# Altium project SencoreIB.PrjPcb
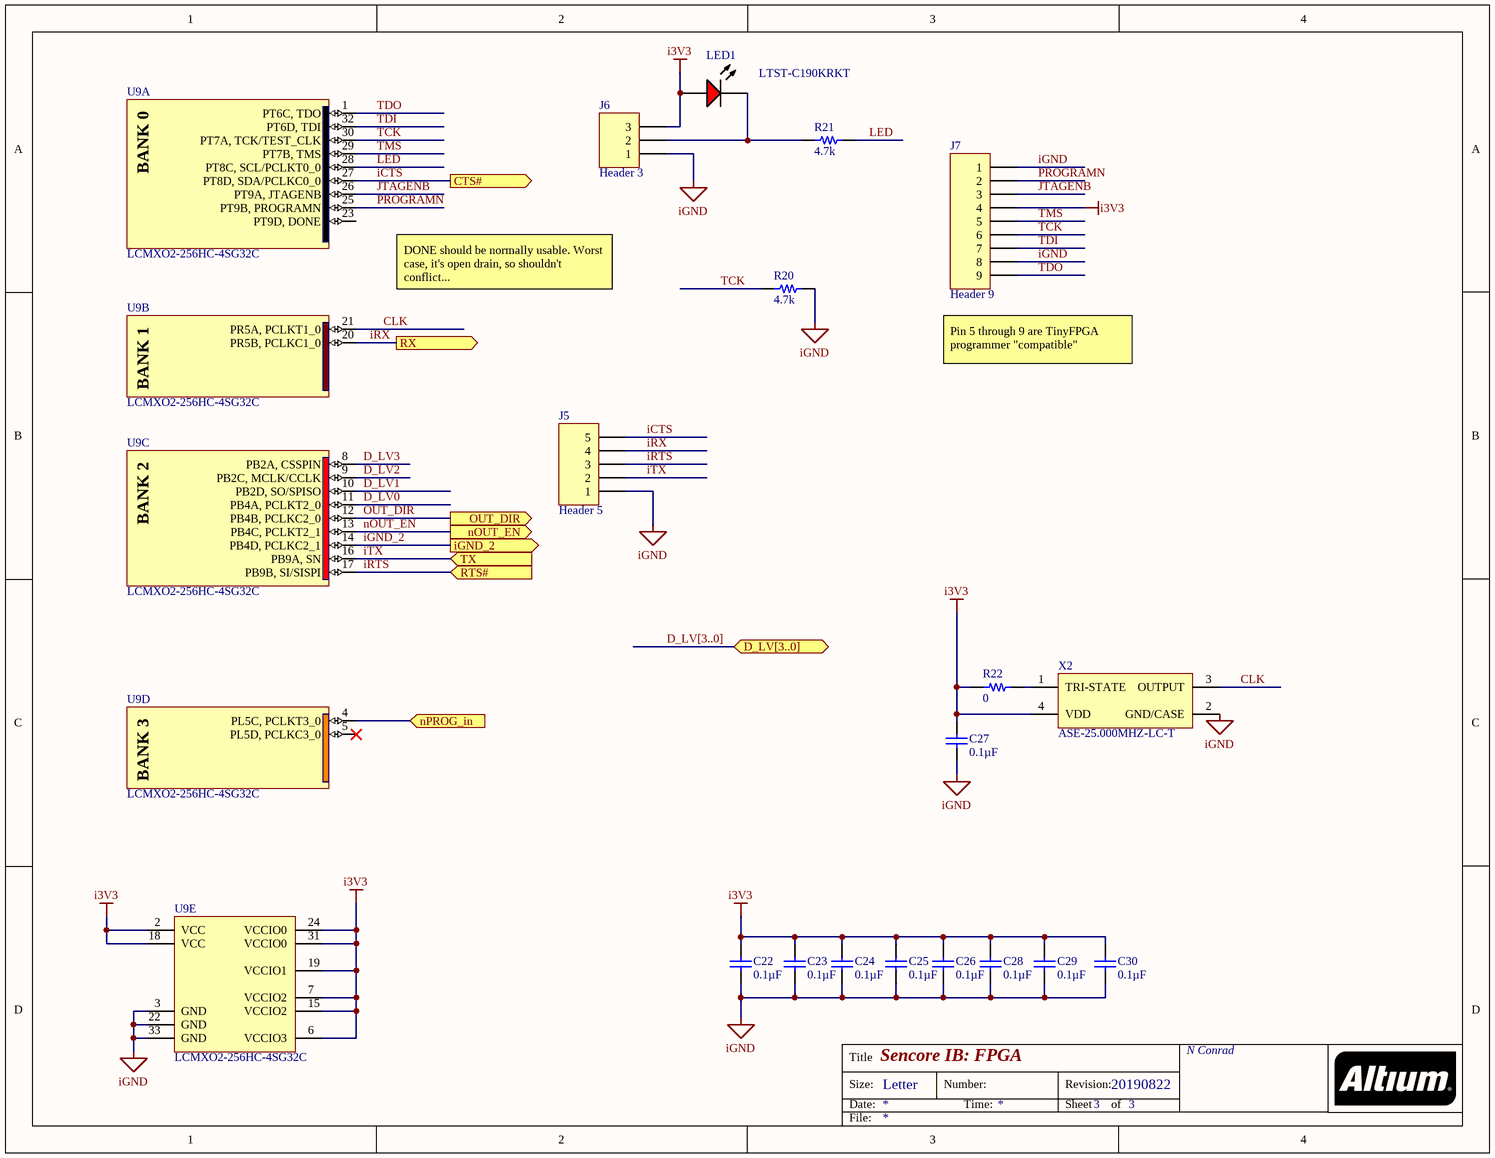
[diagram p0: FPGA.SchDoc]
Revision: 20190817
1 sheet, 18 parts. Net scope: flat (ports and power ports of the same name join across sheets).
Board file: PCB1.PcbDoc

## Sheet FPGA.SchDoc: Sencore IB: FPGA
size Letter; Organization: N Conrad; Revision: 20190822; SheetNumber: 3; SheetTotal: 3; Status: Prototype

### Parts
C22  value 0.1µF  [CAPC1608X09L_GRM]  (hidden comment: Capacitor)
C23  value 0.1µF  [CAPC1608X09L_GRM]  (hidden comment: Capacitor)
C24  value 0.1µF  [CAPC1608X09L_GRM]  (hidden comment: Capacitor)
C25  value 0.1µF  [CAPC1608X09L_GRM]  (hidden comment: Capacitor)
C26  value 0.1µF  [CAPC1608X09L_GRM]  (hidden comment: Capacitor)
C27  value 0.1µF  [CAPC1608X09L_GRM]  (hidden comment: Capacitor)
C28  value 0.1µF  [CAPC1608X09L_GRM]  (hidden comment: Capacitor)
C29  value 0.1µF  [CAPC1608X09L_GRM]  (hidden comment: Capacitor)
C30  value 0.1µF  [CAPC1608X09L_GRM]  (hidden comment: Capacitor)
J5  Header 5  [HDR1X5]
J6  Header 3  [HDR1X3]
J7  Header 9  [HDR1X9]
LED1  LTST-C190KRKT  [LTST-C191KRKT_V]
R20  4.7k  [RESC1608X06L_Yageo0603]
R21  4.7k  [RESC1608X06L_Yageo0603]
R22  0  [RESC1608X06L_Yageo0603]
U9  LCMXO2-256HC-4SG32C  [QFN50P500X500X60_HS-33NH_Lattice_QFN32_SG32C]  (parts A,B,C,D,E of 5)
X2  ASE-25.000MHZ-LC-T  [ABRA-ASE_V]

### Ports
CTS# (out), D_LV[3..0] (bidir), iGND_2 (out), nOUT_EN (out), nPROG_in (in), OUT_DIR (out), RTS# (in), RX (out), TX (in)

### Nets
i3V3: C22.2 C23.2 C24.2 C25.2 C26.2 C27.2 C28.2 C29.2 C30.2 J6.3 J7.4 LED1.1(A) R22.2 U9.2(VCC) U9.6(VCCIO3) U9.7(VCCIO2) U9.15(VCCIO2) U9.18(VCC) U9.19(VCCIO1) U9.24(VCCIO0) U9.31(VCCIO0) X2.4(VDD)
iGND: C22.1 C23.1 C24.1 C25.1 C26.1 C27.1 C28.1 C29.1 C30.1 J5.1 J6.1 J7.1 J7.8 R20.2 U9.3(GND) U9.22(GND) U9.33(GND) X2.2(GND/CASE)
CLK: U9.21(PR5A,_PCLKT1_0) X2.3(OUTPUT)
D_LV0: U9.11(PB4A,_PCLKT2_0)
D_LV1: U9.10(PB2D,_SO/SPISO)
D_LV2: U9.9(PB2C,_MCLK/CCLK)
D_LV3: U9.8(PB2A,_CSSPIN)
iCTS: J5.5 U9.27(PT8D,_SDA/PCLKC0_0) ; port CTS#
iGND_2: U9.14(PB4D,_PCLKC2_1) ; port iGND_2
iRTS: J5.3 U9.17(PB9B,_SI/SISPI) ; port RTS#
iRX: J5.4 U9.20(PR5B,_PCLKC1_0) ; port RX
iTX: J5.2 U9.16(PB9A,_SN) ; port TX
JTAGENB: J7.3 U9.26(PT9A,_JTAGENB)
LED: R21.2 U9.28(PT8C,_SCL/PCLKT0_0)
nOUT_EN: U9.13(PB4C,_PCLKT2_1) ; port nOUT_EN
OUT_DIR: U9.12(PB4B,_PCLKC2_0) ; port OUT_DIR
PROGRAMN: J7.2 U9.25(PT9B,_PROGRAMN)
TCK: J7.6 R20.1 U9.30(PT7A,_TCK/TEST_CLK)
TDI: J7.7 U9.32(PT6D,_TDI)
TDO: J7.9 U9.1(PT6C,_TDO)
TMS: J7.5 U9.29(PT7B,_TMS)
NetJ6_2: J6.2 LED1.2(K) R21.1
NetR22_1: R22.1 X2.1(TRI-STATE)
NetU9_4: U9.4(PL5C,_PCLKT3_0) ; port nPROG_in

Not connected (* = marked no-connect by the designer): U9 5(PL5D,_PCLKC3_0)* 23(PT9D,_DONE)

### Buses and harness runs
bus D_LV[3..0] = port D_LV[3..0]

### Notes on the sheet
- DONE should be normally usable. Worst case, it's open drain, so shouldn't conflict...
- (near J7) Pin 5 through 9 are TinyFPGA programmer "compatible"
- Title
- Size:
- Date:
- Letter
- Number:
- Time:
- Revision:
- Sheet
- of
- File:
- (in symbol LCMXO2-256HC-4SG32C, part A) BANK 0
- (in symbol LCMXO2-256HC-4SG32C, part B) BANK 1
- (in symbol LCMXO2-256HC-4SG32C, part C) BANK 2
- (in symbol LCMXO2-256HC-4SG32C, part D) BANK 3

### Library data of the parts
C22-C30 = GCJ188R71H104KA12D: CAP CER 0.1UF 50V X7R 0603; Manufacturer 1: Murata Electronics North America; Manufacturer Lifecycle 1: Active; Factory Stock: 0; Minimum Quantity: 1; Tolerance: ±10%; Unit Price (USD): 0.31000; Part Number: GCJ188R71H104KA12D; Applications: Automotive, Boardflex Sensitive; ComponentLink1Description: Datasheet; ComponentLink1URL: https://www.murata.com/~/media/webrenewal/support/library/catalog/products/capacitor/mlcc/c03e.ashx?la=en-us; Supplier Part Number 1: 490-5798-1-ND; Features: Soft Termination; Image: https://media.digikey.com/Renders/Murata%20Renders/0603%28LQG18%29.jpg; Manufacturer Part Number 1: GCJ188R71H104KA12D; Mounting Type: Surface Mount, MLCC; Operating Temperature: -55°C ~ 125°C; Package / Case: 0603 (1608 Metric); Packaging: Cut Tape (CT); Stock 1: 2693341; Ratings: AEC-Q200; Series: GCJ; Size / Dimension: 0.063" L x 0.031" W (1.60mm x 0.80mm); Supplier 1: Digi-Key; Temperature Coefficient: X7R; Thickness (Max): 0.035" (0.90mm); Voltage - Rated: 50V
J5 = Header 5: Header, 5-Pin; LatestRevisionDate: 17-Jul-2002; LatestRevisionNote: Re-released for DXP Platform.; Publisher: Altium Limited
J6 = Header 3: Header, 3-Pin; LatestRevisionDate: 17-Jul-2002; LatestRevisionNote: Re-released for DXP Platform.; Publisher: Altium Limited
J7 = Header 9: Header, 9-Pin; LatestRevisionDate: 17-Jul-2002; LatestRevisionNote: Re-released for DXP Platform.; Publisher: Altium Limited
LED1 = CMP-1674-00011-1: LED Uni-Color Red, 62.5 mW, 5 V, -30 to 85 degC, 2-Pin SMD, RoHS, Tape and Reel; Capacitance: 100 uF; Voltage Rating: 50 V; Case\Package: Radial; Tolerance: 20%; Packaging: Bulk; REACH SVHC: No SVHC; ComponentLink1Description: Manufacturer URL; ComponentLink2URL: http://optoelectronics.liteon.com/upload/download/DS-22-99-0151/S_110_LTST-C190KRKT.pdf; Max Operating Temperature: 85 degC; DatasheetVersion: Rev. F, 05/2013; Pins: 2; Voltage Rating (DC): 50 V; Mount: Through Hole; Lead Pitch: 3.5 mm; Diameter: 8 mm; ComponentLink1URL: http://www.us.liteon.com/; Radiation Hardening: No; Package Quantity: 200; PackageReference: C191KRKT; RoHSCompliant: true; Height: 11.5 mm; PackageDescription: 2-Pin Surface Mount Device, Body 1.6 x 0.8 mm; Length: 11.5 mm; ComponentLink2Description: Datasheet; Min Operating Temperature: -40 degC
R20 R21 = RC0603JR-074K7L: RES SMD 4.7K OHM 5% 1/10W 0603; Manufacturer 1: Yageo; Manufacturer Lifecycle 1: Active; Factory Stock: 0; Minimum Quantity: 1; Power (Watts): 0.1W, 1/10W; Temperature Coefficient: ±100ppm/°C; Unit Price (USD): 0.10000; Value: 4.7k; Part Number: RC0603JR-074K7L; ComponentLink1Description: Datasheet; Composition: Thick Film; ComponentLink1URL: http://www.yageo.com/documents/recent/PYu-RC_Group_51_RoHS_L_9.pdf; Supplier Part Number 1: 311-4.7KGRCT-ND; Features: Moisture Resistant; Height - Seated (Max): 0.022" (0.55mm); Image: https://media.digikey.com/Renders/Yageo%20Renders/0603-(1608-Metric).jpg; Manufacturer Part Number 1: RC0603JR-074K7L; Number of Terminations: 2; Operating Temperature: -55°C ~ 155°C; Package / Case: 0603 (1608 Metric); Packaging: Cut Tape (CT); Stock 1: 0; Series: RC; Size / Dimension: 0.063" L x 0.032" W (1.60mm x 0.80mm); Supplier 1: Digi-Key; Supplier Device Package: 0603; Tolerance: ±5%
R22 = RC0603JR-070RL: RES SMD 0 OHM JUMPER 1/10W 0603; Manufacturer 1: Yageo; Manufacturer Lifecycle 1: Active; Minimum Quantity: 1; Power (Watts): 0.1W, 1/10W; Unit Price (USD): 0.10000; Value: 0; Part Number: RC0603JR-070RL; ComponentLink1Description: Datasheet; Composition: Thick Film; ComponentLink1URL: http://www.yageo.com/documents/recent/PYu-RC_Group_51_RoHS_L_9.pdf; Supplier Part Number 1: 311-0.0GRCT-ND; Factory Stock: 0; Features: Moisture Resistant; Height - Seated (Max): 0.022" (0.55mm); Image: https://media.digikey.com/Renders/Yageo%20Renders/0603-(1608-Metric).jpg; Manufacturer Part Number 1: RC0603JR-070RL; Number of Terminations: 2; Operating Temperature: -55°C ~ 155°C; Package / Case: 0603 (1608 Metric); Packaging: Cut Tape (CT); Stock 1: 0; Series: RC; Size / Dimension: 0.063" L x 0.032" W (1.60mm x 0.80mm); Supplier 1: Digi-Key; Supplier Device Package: 0603; Tolerance: Jumper
U9 = LCMXO2-256HC-4SG32C: IC FPGA 21 I/O 32QFN; Manufacturer 1: Lattice Semiconductor; Number of I/Os: 22; Max Supply Voltage: 3.465V; Min Supply Voltage: 2.375V; Number of Logic Elements/Cells: 256; Number of Logic Blocks (LABs): 32; Memory Size: 2Kb; Memory Type: FLASH; RAM Size: 0b; Max Frequency: 269MHz; Operating Supply Voltage: 3.3V; Operating Supply Current: 18uA; Number of Macrocells: 128; Supplier 1: Digi-Key; Supplier Part Number 1: 220-2636-ND; Stock 1: 964; Pricing 1: 1=3.24000, 25=2.83800, 100=2.75730 (USD); RoHS: Yes; Mount: Surface Mount; Case/Package: QFN; Number of Pins: 32; Min Operating Temperature: 0°C; Max Operating Temperature: 85°C; Packaging: Tray; Number of Gates: 256; Package Quantity: 490; Radiation Hardening: No; Lead Free: Lead Free; ComponentLink1URL: https://datasheet.ciiva.com/12203/machxo2productfamilyqualificationsummary-311355-12203733.pdf?src-supplier=Mouser; ComponentLink1Description: https://datasheet.ciiva.com/12203/machxo2productfamilyqualificationsummary-311355-12203733.pdf?src-supplier=Mouser; Manufacturer Part Number 1: LCMXO2-256HC-4SG32C
X2 = CMP-2000-05795-1: CMOS Crystal Oscillatorl, 3.3 V, 25 MHz, +/- 50 ppm, -40 to 85 degC, 4-Pin SMD, RoHS, Tape and Reel; Manufacturer: Abracon; Operating Frequency: 25MHz; Supply Voltage: 3.3V; Frequency Stability: ±50ppm; Datasheet Version: 03/2014; Package Reference: ASE; Mounting Technology: SurfaceMount; Package Description: 4-Pin Surface Mount Device, Body 3.2 x 2.5 mm, Pitch 2.1 mm; Datasheet URL: http://www.abracon.com/Oscillators/ASEseries.pdf; Manufacturer URL: http://www.abracon.com/; Operating Temp Range: -40to+85°C; Dimension: 3.2x2.5x1.1mm

## Assembly variants
Standard: all parts fitted